# EAGLE design BSPD 4 - Copy (EAGLE 7.7.0)
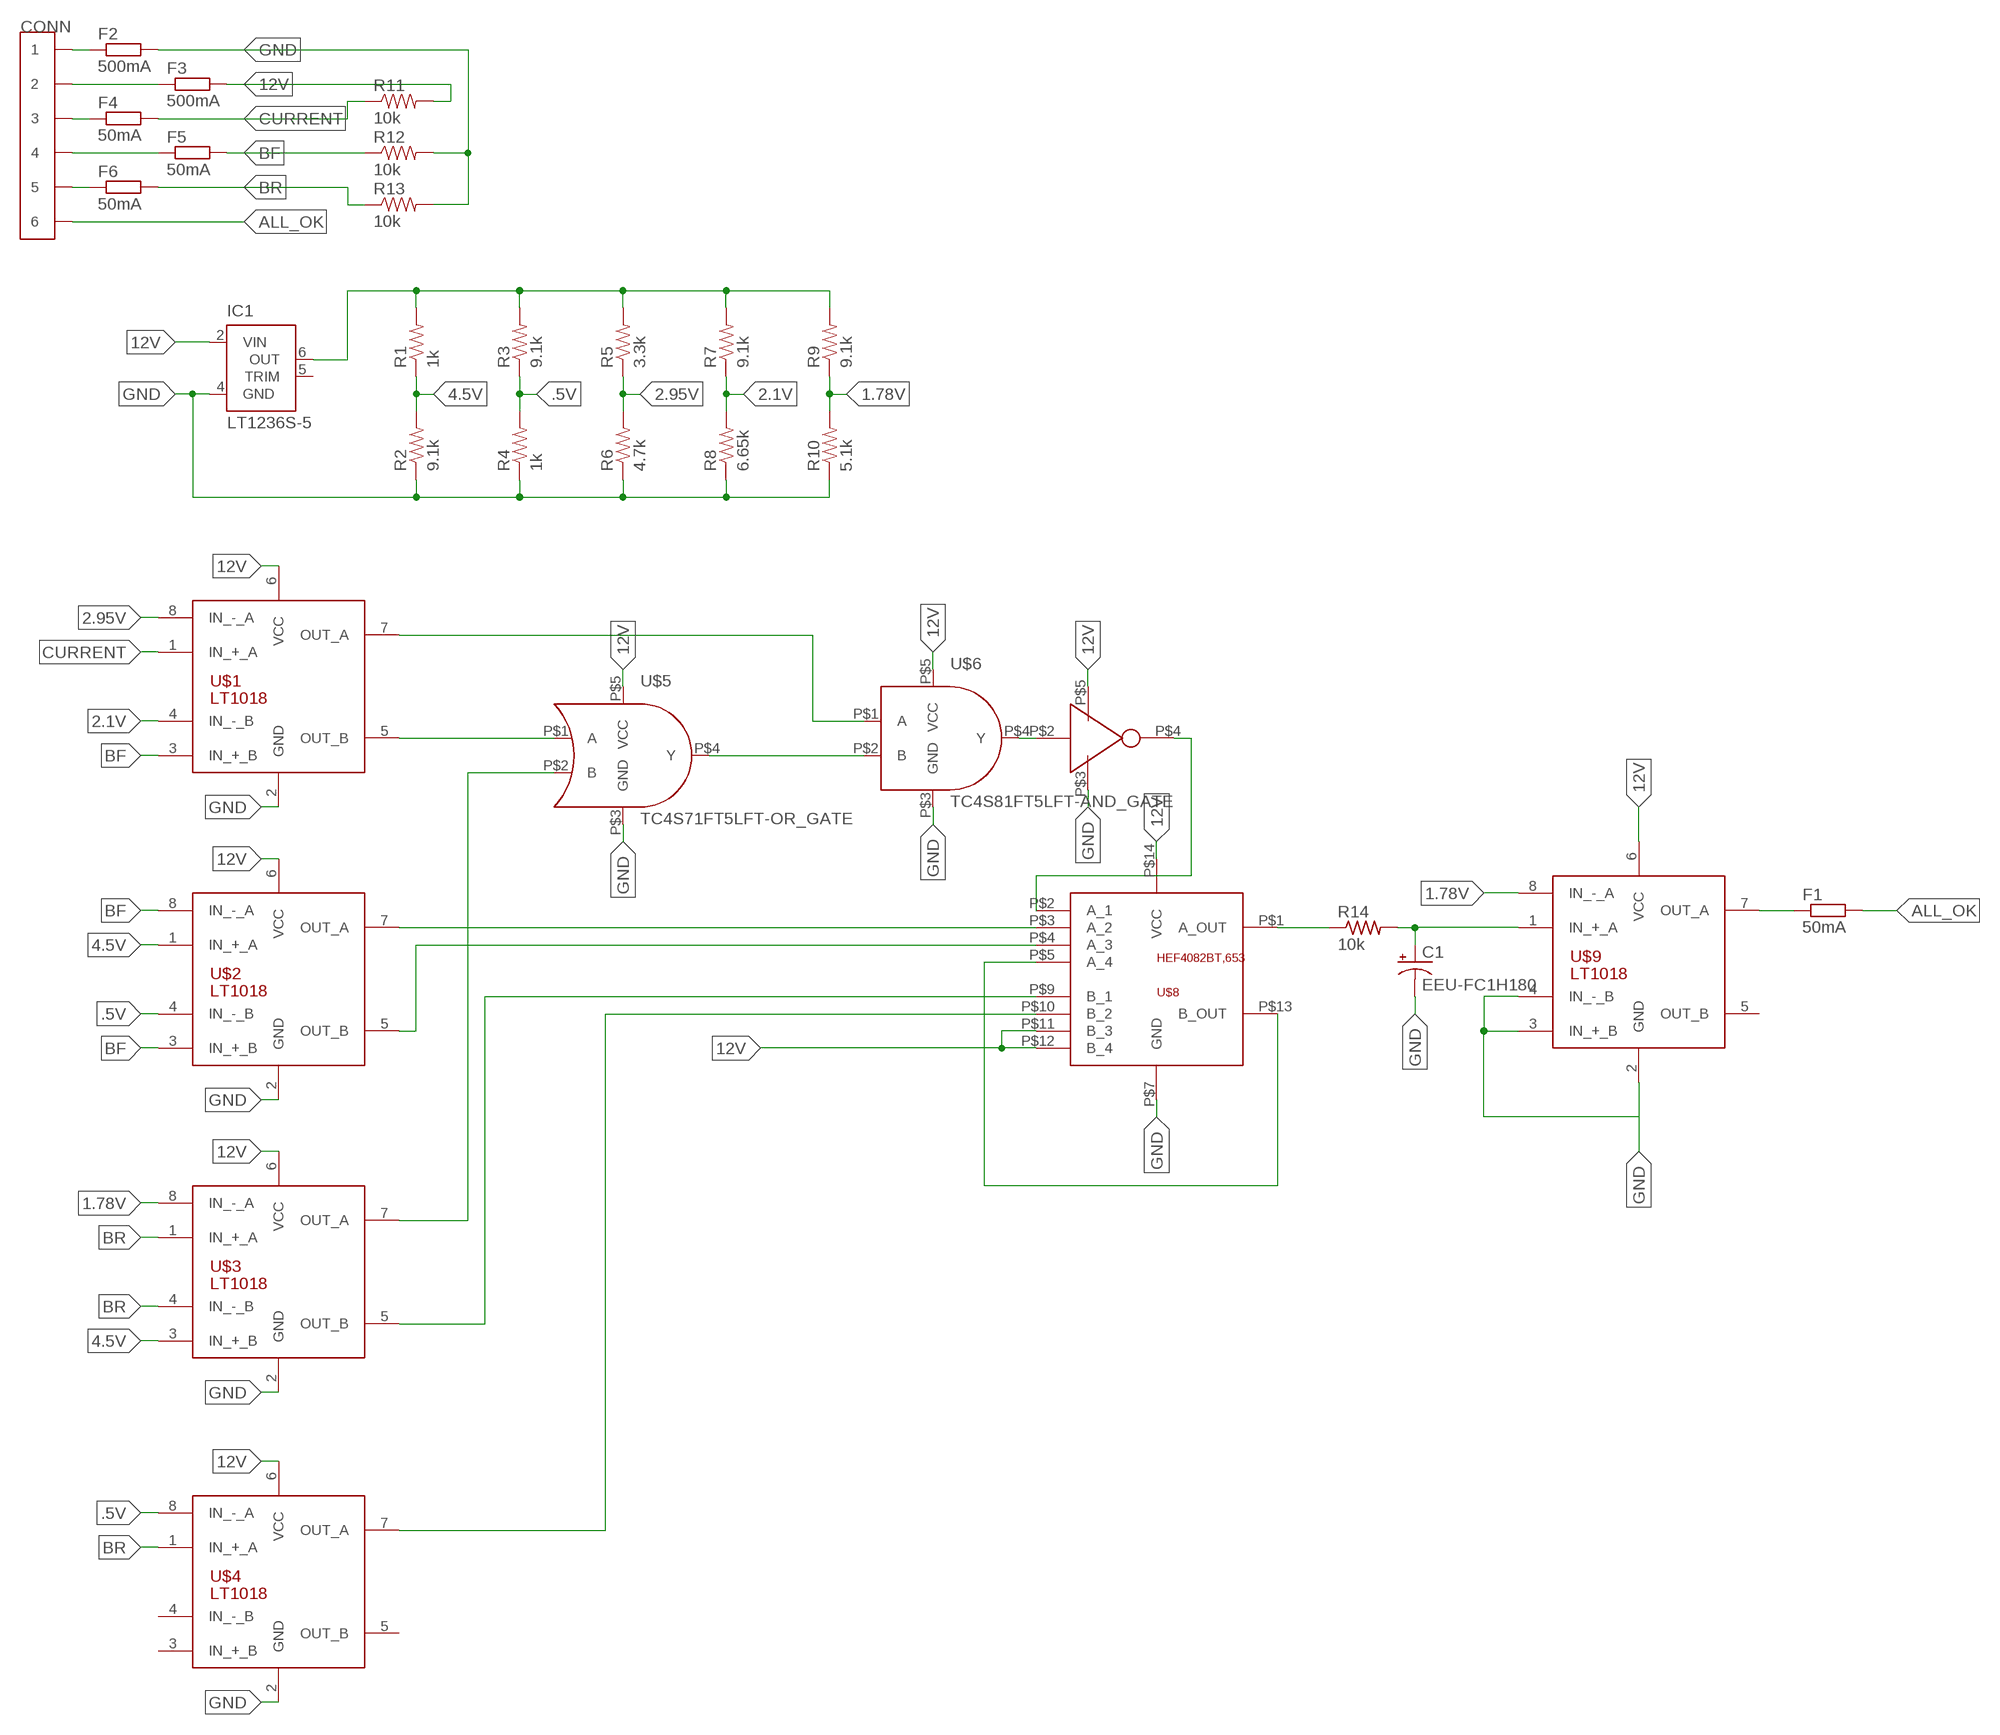
[diagram p0: schematic, sheet 1]

## Parts
C1  EEU-FC1H180  CPOL-USE2-5  [E2-5]
CONN  CONN_6  [CONNECTOR_6]
F1  50mA  R-EU_R0603  [R0603]
F2  500mA  R-EU_R0603  [R0603]
F3  500mA  R-EU_R0603  [R0603]
F4  50mA  R-EU_R0603  [R0603]
F5  50mA  R-EU_R0603  [R0603]
F6  50mA  R-EU_R0603  [R0603]
IC1  LT1236S-5  [SOIC8]
R1  1k  RESISTOR0603  [0603-RES]
R2  9.1k  RESISTOR0603  [0603-RES]
R3  9.1k  RESISTOR0603  [0603-RES]
R4  1k  RESISTOR0603  [0603-RES]
R5  3.3k  RESISTOR0603  [0603-RES]
R6  4.7k  RESISTOR0603  [0603-RES]
R7  9.1k  RESISTOR0603  [0603-RES]
R8  6.65k  RESISTOR0603  [0603-RES]
R9  9.1k  RESISTOR0603  [0603-RES]
R10  5.1k  RESISTOR0603  [0603-RES]
R11  10k  RESISTOR0603  [0603-RES]
R12  10k  RESISTOR0603  [0603-RES]
R13  10k  RESISTOR0603  [0603-RES]
R14  10k  R-US_R0603  [R0603]
U$1  LT1018  [SOIC8]
U$2  LT1018  [SOIC8]
U$3  LT1018  [SOIC8]
U$4  LT1018  [SOIC8]
U$5  TC4S71FT5LFT-OR_GATE  [SSOP5-P-0.95]
U$6  TC4S81FT5LFT-AND_GATE  [SSOP5-P-0.95]
U$7  TC4S69F(TE85L,F)  [SSOP5-P-0.95]
U$8  HEF4082BT,653  [NXP_14_SOIC]
U$9  LT1018  [SOIC8]

## Nets
1.78V: R9.1 R10.2 U$3.8(IN_-_A) U$9.8(IN_-_A)
2.1V: R7.1 R8.2 U$1.4(IN_-_B)
2.95V: R5.1 R6.2 U$1.8(IN_-_A)
4.5V: R1.1 R2.2 U$2.1(IN_+_A) U$3.3(IN_+_B)
12V: F3.2 IC1.2(VIN) R11.2 U$1.6(VCC) U$2.6(VCC) U$3.6(VCC) U$4.6(VCC) U$5.P$5(VCC) U$6.P$5(VCC) U$7.P$5(VCC) U$8.P$11(B_3) U$8.P$12(B_4) U$8.P$14(VCC) U$9.6(VCC)
.5V: R3.1 R4.2 U$2.4(IN_-_B) U$4.8(IN_-_A)
ALL_OK: CONN.11 CONN.12 F1.2
BF: F5.2 R12.1 U$1.3(IN_+_B) U$2.3(IN_+_B) U$2.8(IN_-_A)
BR: F6.2 R13.1 U$3.1(IN_+_A) U$3.4(IN_-_B) U$4.1(IN_+_A)
CURRENT: F4.2 R11.1 U$1.1(IN_+_A)
GND: C1.- F2.2 IC1.4(GND) R2.1 R4.1 R6.1 R8.1 R10.1 R12.2 R13.2 U$1.2(GND) U$2.2(GND) U$3.2(GND) U$4.2(GND) U$5.P$3(GND) U$6.P$3(GND) U$7.P$3(GND) U$8.P$7(GND) U$9.2(GND) U$9.3(IN_+_B) U$9.4(IN_-_B)
N$1: IC1.6(OUT) R1.2 R3.2 R5.2 R7.2 R9.2
N$2: U$1.5(OUT_B) U$5.P$1(A)
N$3: U$3.7(OUT_A) U$5.P$2(B)
N$4: U$5.P$4(Y) U$6.P$2(B)
N$5: U$1.7(OUT_A) U$6.P$1(A)
N$6: U$6.P$4(Y) U$7.P$2(IN)
N$7: U$7.P$4(OUT) U$8.P$2(A_1)
N$8: U$2.7(OUT_A) U$8.P$3(A_2)
N$9: U$2.5(OUT_B) U$8.P$4(A_3)
N$10: U$8.P$5(A_4) U$8.P$13(B_OUT)
N$11: U$3.5(OUT_B) U$8.P$9(B_1)
N$12: U$4.7(OUT_A) U$8.P$10(B_2)
N$13: R14.1 U$8.P$1(A_OUT)
N$14: C1.+ R14.2 U$9.1(IN_+_A)
N$15: F1.1 U$9.7(OUT_A)
N$16: CONN.1 CONN.2 F2.1
N$17: CONN.3 CONN.4 F3.1
N$18: CONN.5 CONN.6 F4.1
N$19: CONN.7 CONN.8 F5.1
N$20: CONN.9 CONN.10 F6.1
Unconnected: IC1.5(TRIM) U$4.3(IN_+_B) U$4.4(IN_-_B) U$4.5(OUT_B) U$9.5(OUT_B)

## Library data of the parts
C1 = resistor:CPOL-US: POLARIZED CAPACITOR, American symbol
CONN = formula electric:CONN_6
F1-F6 = resistor:R-EU_: RESISTOR, European symbol
IC1 = linear-technology:LT1236?*: Precision Voltage Reference Source: http://www.linear.com/pc/downloadDocument.do?navId=H0,C1,C1154,C1002,C1243,P1156,D2948; OC_FARNELL: unknown; OC_NEWARK: unknown
R1-R13 = SparkFun-Resistors:RESISTOR: Resistor Basic schematic elements and footprints for 0603, 1206, and PTH resistors.
R14 = resistor:R-US_: RESISTOR, American symbol
U$1-U$4 U$9 = linear-technology:LT1018
U$5 = formula electric:TC4S71FT5LFT-OR_GATE
U$6 = formula electric:TC4S81FT5LFT-AND_GATE: TC4S81FT5LFTCT-ND
U$7 = formula electric:TC4S69F(TE85L,F)
U$8 = formula electric:HEF4082BT,653: 568-7702-1-ND

## Board
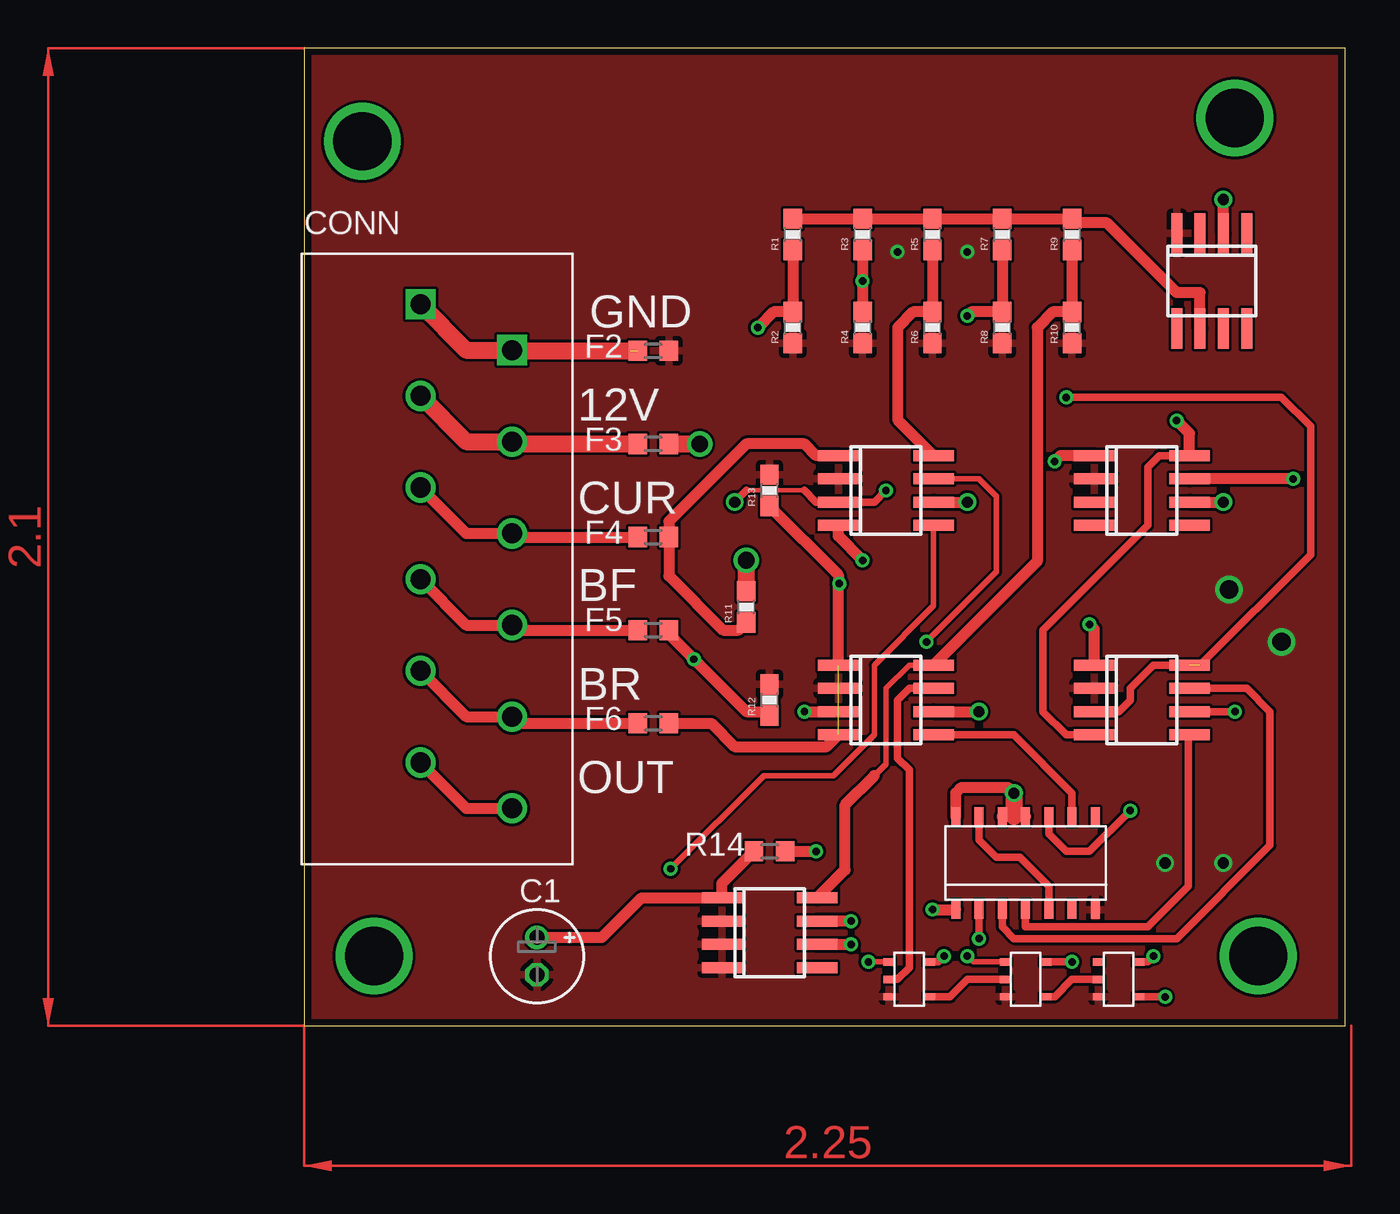
[diagram p1: board, top side]
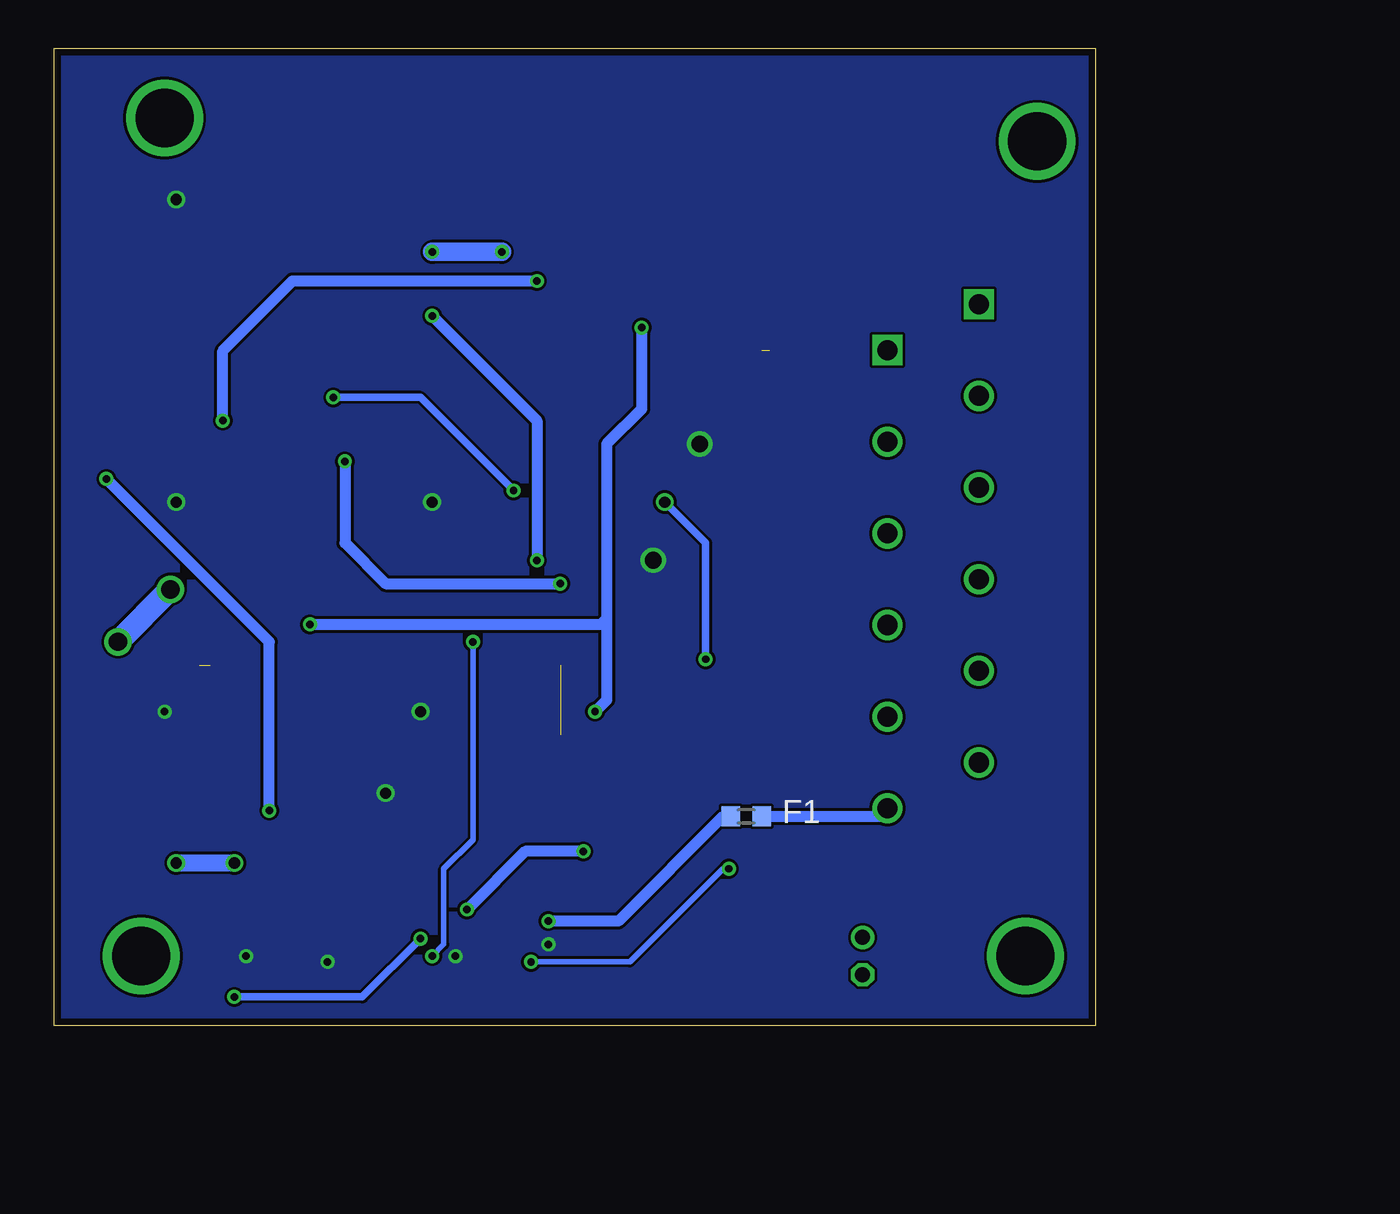
[diagram p2: board, bottom side, seen from below]

Size 56.82 x 53.33 mm. Coordinates in mm from the lower left corner, seen from the top.
Outline: 0,0 56.82,0 56.82,53.33 0,53.33 0,0
Copper layers (1*16): Top 0.0356mm / dielectric 1.5011mm / Bottom 0.0356mm
Design rules "OshPark DRC": minimum track width 6mil, minimum drill 13mil, track to track 6mil, track to pad 6mil, pad to pad 6mil, via to via 6mil, smd to smd 6mil, copper to edge 15mil, drill to drill 6mil, minimum pad ring 7mil, minimum via ring 7mil, stop-mask expansion 3mil, vias tented up to drill 0mil, thermal gap 10mil

### Footprints (pad centres in the part's own frame; a part is rotated, then mirrored left to right if it is on the bottom)
E2-5 = drill 0.813 pad 1.27: + -1.016,0 | drill 0.813 pad 1.27 octagon: - 1.016,0
CONNECTOR_6 = drill 1.1 square: 1 0,0; 2 2.5,5 | drill 1.1: 3 5,0; 4 7.5,5; 5 10,0; 6 12.5,5; 7 15,0; 8 17.5,5; 9 20,0; 10 22.5,5; 11 25,0; 12 27.5,5
R0603 = smd 1 x 1.1: 1 -0.85,0; 2 0.85,0
SOIC8 = smd 0.6 x 2.2: 1 -1.905,-2.6; 2 -0.635,-2.6; 3 0.635,-2.6; 4 1.905,-2.6; 5 1.905,2.6; 6 0.635,2.6; 7 -0.635,2.6; 8 -1.905,2.6
0603-RES = smd 1.1 x 1: 1 -0.85,0; 2 0.85,0
SSOP5-P-0.95 = smd 0.6 x 0.4: P$1 -1.1,0.95; P$2 -1.1,0; P$3 -1.1,-0.95; P$4 1.1,-0.95; P$5 1.1,0.95
NXP_14_SOIC = smd 0.49 x 1: P$1 -3.81,-2.54; P$2 -2.54,-2.54; P$3 -1.27,-2.54; P$4 0,-2.54; P$5 1.27,-2.54; P$6 2.54,-2.54; P$7 3.81,-2.54; P$8 3.81,2.54; P$9 2.54,2.54; P$10 1.27,2.54; P$11 0,2.54; P$12 -1.27,2.54; P$13 -2.54,2.54; P$14 -3.81,2.54

### Placement (x,y rotation side)
C1  12.7,3.81 270 top
CONN  6.35,39.37 270 top
F1  19.05,11.43 0 bottom
F2  19.05,36.83 0 top
F3  19.05,31.75 0 top
F4  19.05,26.67 0 top
F5  19.05,21.59 0 top
F6  19.05,16.51 0 top
IC1  49.53,40.64 180 top
R1  26.67,43.18 90 top
R2  26.67,38.1 90 top
R3  30.48,43.18 90 top
R4  30.48,38.1 90 top
R5  34.29,43.18 90 top
R6  34.29,38.1 90 top
R7  38.1,43.18 90 top
R8  38.1,38.1 90 top
R9  41.91,43.18 90 top
R10  41.91,38.1 90 top
R11  24.13,22.86 90 top
R12  25.4,17.78 90 top
R13  25.4,29.21 90 top
R14  25.4,9.53 180 top
U$1  31.75,29.21 270 top
U$2  45.72,17.78 270 top
U$3  31.75,17.78 270 top
U$4  45.72,29.21 270 top
U$5  33.02,2.54 0 top
U$6  39.37,2.54 0 top
U$7  44.45,2.54 0 top
U$8  39.37,8.89 0 top
U$9  25.4,5.08 270 top

### Tracks (layer width: path | path; a pad name or v marks a point on that pad's centre or on a via)
1.78V
  Top 0.305: 31.11,13.65 31.75,14.29 31.75,18.41 33.02,19.68 U$3.8
  Top 0.61: R9.1 R10.2 40.85,38.95 40.01,38.1 40.01,25.34 U$3.8 | U$9.8 29.53,8.51 29.53,12.06 31.11,13.65
2.1V  (via drill 0.41)
  Top 0.61: R7.1 R8.2 36.41,38.95 v36.2,38.73 | v30.48,25.4 29.15,26.73 U$1.4
  Bottom 0.61: v36.2,38.73 30.48,33.02 v30.48,25.4
2.95V
  Top 0.61: R5.1 R6.2 33.23,38.95 32.38,38.1 32.38,33.08 U$1.8 34.29,31.18
4.5V  (via drill 0.41)
  Top 0.61: R1.1 R2.2 25.61,38.95 v24.77,38.1 | v27.3,17.14 U$3.3 | U$2.1 43.12,21.65 v42.86,21.91
  Bottom 0.61: v24.77,38.1 24.77,33.66 26.67,31.75 26.67,22.23 | 26.67,22.23 26.67,17.78 v27.3,17.14 | v42.86,21.91 26.99,21.91 26.67,22.23
12V  (via drill 0.41, 0.61, 0.91)
  Top 0.406: U$7.P$5 46.03,3.49 v46.35,3.81 | U$6.P$5 40.95,3.49 v41.91,3.49 | U$5.P$5 34.6,3.49 v34.92,3.81 | U$2.6 v50.8,17.14
  Top 0.61: U$1.6 v36.2,28.57 | U$3.6 v36.83,17.14 | U$4.6 v50.16,28.57 | U$8.P$12 38.73,11.43 U$8.P$11 | IC1.2 v50.16,45.09 | U$9.6 v29.84,4.45 | U$8.P$14 35.56,12.7 35.88,13.02 38.42,13.02 v38.73,12.7
  Top 0.914: F3.2 v21.59,31.75 | R11.2 v24.13,25.4 | v38.73,12.7 38.73,11.43
  pour Bottom: 0,53.34 57.15,53.34 57.15,0 0,0
.5V  (via drill 0.41)
  Top 0.406: U$2.4 41.59,15.88 40.32,17.14 40.32,21.59 46.04,27.3 46.04,30.48 46.67,31.11 U$4.8
  Top 0.61: R3.1 v30.48,40.64 R4.2 | U$4.8 48.32,32.33 v47.62,33.02
  Bottom 0.61: v47.62,33.02 47.62,36.83 43.81,40.64 v30.48,40.64
ALL_OK
  Top 0.61: CONN.11 8.85,11.87 CONN.12
  Bottom 0.61: F1.2 11.79,11.43 CONN.12
BF  (via drill 0.41, 0.61)  (1 unrouted)
  Top 0.254: 27.3,29.21 24.13,29.21
  Top 0.406: U$2.8 46.35,19.68 45.09,18.41 45.09,17.78 44.45,17.14 U$2.3 | 27.3,29.21 27.94,28.57 U$1.3 31.11,28.57 v31.75,29.21 | 24.13,29.21 v23.5,28.57 | 48.9,19.68 54.93,25.72 54.93,32.7 53.34,34.29 v41.59,34.29
  Top 0.61: F5.2 19.9,21.38 v21.27,20 24.13,17.14 25.18,17.14 R12.1
  Bottom 0.406: v23.5,28.57 21.27,26.35 v21.27,20 | v31.75,29.21 36.83,34.29 v41.59,34.29
BR  (via drill 0.41)  (1 unrouted)
  Top 0.61: F6.2 22.23,16.51 23.5,15.24 28.52,15.24 U$3.4 | U$3.1 29.15,24.19 | R13.1 29.15,24.61 29.15,24.19 | U$4.1 41.27,31.11 v40.96,30.8 | 29.15,24.19 v29.21,24.13
  Bottom 0.61: v40.96,30.8 40.96,26.35 38.73,24.13 v29.21,24.13 29.15,24.13
CURRENT
  Top 0.61: R11.1 23.71,21.59 22.86,21.59 19.9,24.55 F4.2 19.9,27.52 24.13,31.75 27.3,31.75 27.94,31.11 U$1.1
GND  (via drill 0.41, 0.61, 1)
  Bottom 0.914: v50.16,8.89 v46.99,8.89
  Bottom 1.016: v32.38,42.23 v36.2,42.23
  Bottom 1.27: v53.34,20.95 v50.48,23.81
  pour Top: 55.88,53.34 0,53.34 0,0 57.15,0 57.15,53.34
N$1
  Top 0.61: R1.2 R3.2 R5.2 R7.2 R9.2 42.12,43.81 43.81,43.81 47.62,40.01 48.9,40.01 IC1.6
N$2  (via drill 0.41)
  Top 0.305: U$1.5 34.35,22.92 31.11,19.68 31.11,15.88 28.89,13.65 25.08,13.65 v20,8.57 | v30.8,3.49 U$5.P$1
  Bottom 0.305: v20,8.57 20.32,8.57 25.4,3.49 v30.8,3.49
N$3
  Top 0.406: U$5.P$2 32.38,2.54 33.02,3.17 33.02,13.97 32.38,14.61 32.38,17.78 33.02,18.41 U$3.7
N$4
  Top 0.406: U$5.P$4 35.24,1.59 36.2,2.54 U$6.P$2
N$5  (via drill 0.41)
  Top 0.305: U$1.7 36.83,29.84 37.78,28.89 37.78,24.77 v33.97,20.95 | v36.2,3.81 36.52,3.49 U$6.P$1
  Bottom 0.305: v33.97,20.95 33.97,10.16 35.56,8.57 35.56,4.45 v36.2,3.81
N$6
  Top 0.406: U$6.P$4 40.96,1.59 41.91,2.54 U$7.P$2
N$7  (via drill 0.41)
  Top 0.406: U$8.P$2 v36.83,4.76 | v46.99,1.59 U$7.P$4
  Bottom 0.406: v36.83,4.76 40.01,1.59 v46.99,1.59
N$8
  Top 0.406: U$8.P$3 38.1,5.4 38.73,4.76 47.62,4.76 52.7,9.84 52.7,17.14 51.44,18.41 U$2.7
N$9
  Top 0.406: U$2.5 48.26,15.81 48.26,7.62 46.04,5.4 39.37,5.4 U$8.P$4
N$10
  Top 0.406: U$8.P$5 40.64,7.62 39.05,9.21 37.78,9.21 36.83,10.16 U$8.P$13
N$11
  Top 0.406: U$8.P$9 41.91,12.7 38.73,15.88 U$3.5
N$12  (via drill 0.41)
  Top 0.406: U$8.P$10 40.64,10.48 41.59,9.53 42.86,9.53 v45.09,11.75
  Top 0.61: v53.98,29.84 U$4.7
  Bottom 0.61: v45.09,11.75 45.09,20.95 v53.98,29.84
N$13  (via drill 0.41)
  Top 0.61: R14.1 v27.94,9.53 | v34.29,6.35 U$8.P$1
  Bottom 0.61: v27.94,9.53 31.11,9.53 v34.29,6.35
N$14
  Top 0.61: C1.+ 16.26,4.83 18.41,6.99 U$9.1 22.8,7.78 R14.2
N$15  (via drill 0.41)
  Top 0.61: v29.84,5.71 U$9.7
  Bottom 0.61: F1.1 20.32,11.43 26.04,5.71 v29.84,5.71
N$16  (1 unrouted)
  Top 0.61: CONN.2 11.39,36.83
  Top 0.914: CONN.1 8.85,36.87 CONN.2 | 11.39,36.83 17.78,36.83
N$17
  Top 0.61: CONN.4 11.47,31.75
  Top 0.914: CONN.3 8.85,31.87 CONN.4 | 11.47,31.75 F3.1
N$18
  Top 0.61: CONN.5 8.85,26.87 CONN.6 11.55,26.67 F4.1
N$19
  Top 0.61: CONN.7 8.85,21.87 CONN.8 11.63,21.59 F5.1
N$20
  Top 0.61: CONN.9 8.85,16.87 CONN.10 11.71,16.51 F6.1
N$21  (via drill 3.17)
  other vias: 3.81,3.81
N$22  (via drill 3.17)
  other vias: 3.17,48.26
N$23  (via drill 3.17)
  other vias: 52.07,3.81
N$24  (via drill 3.17)
  other vias: 50.8,49.53
(copper drawn outside any net)
  shapes: Top area x2

### Text on the board
tPlace: GND | 12V | CUR | BF | BR | OUT